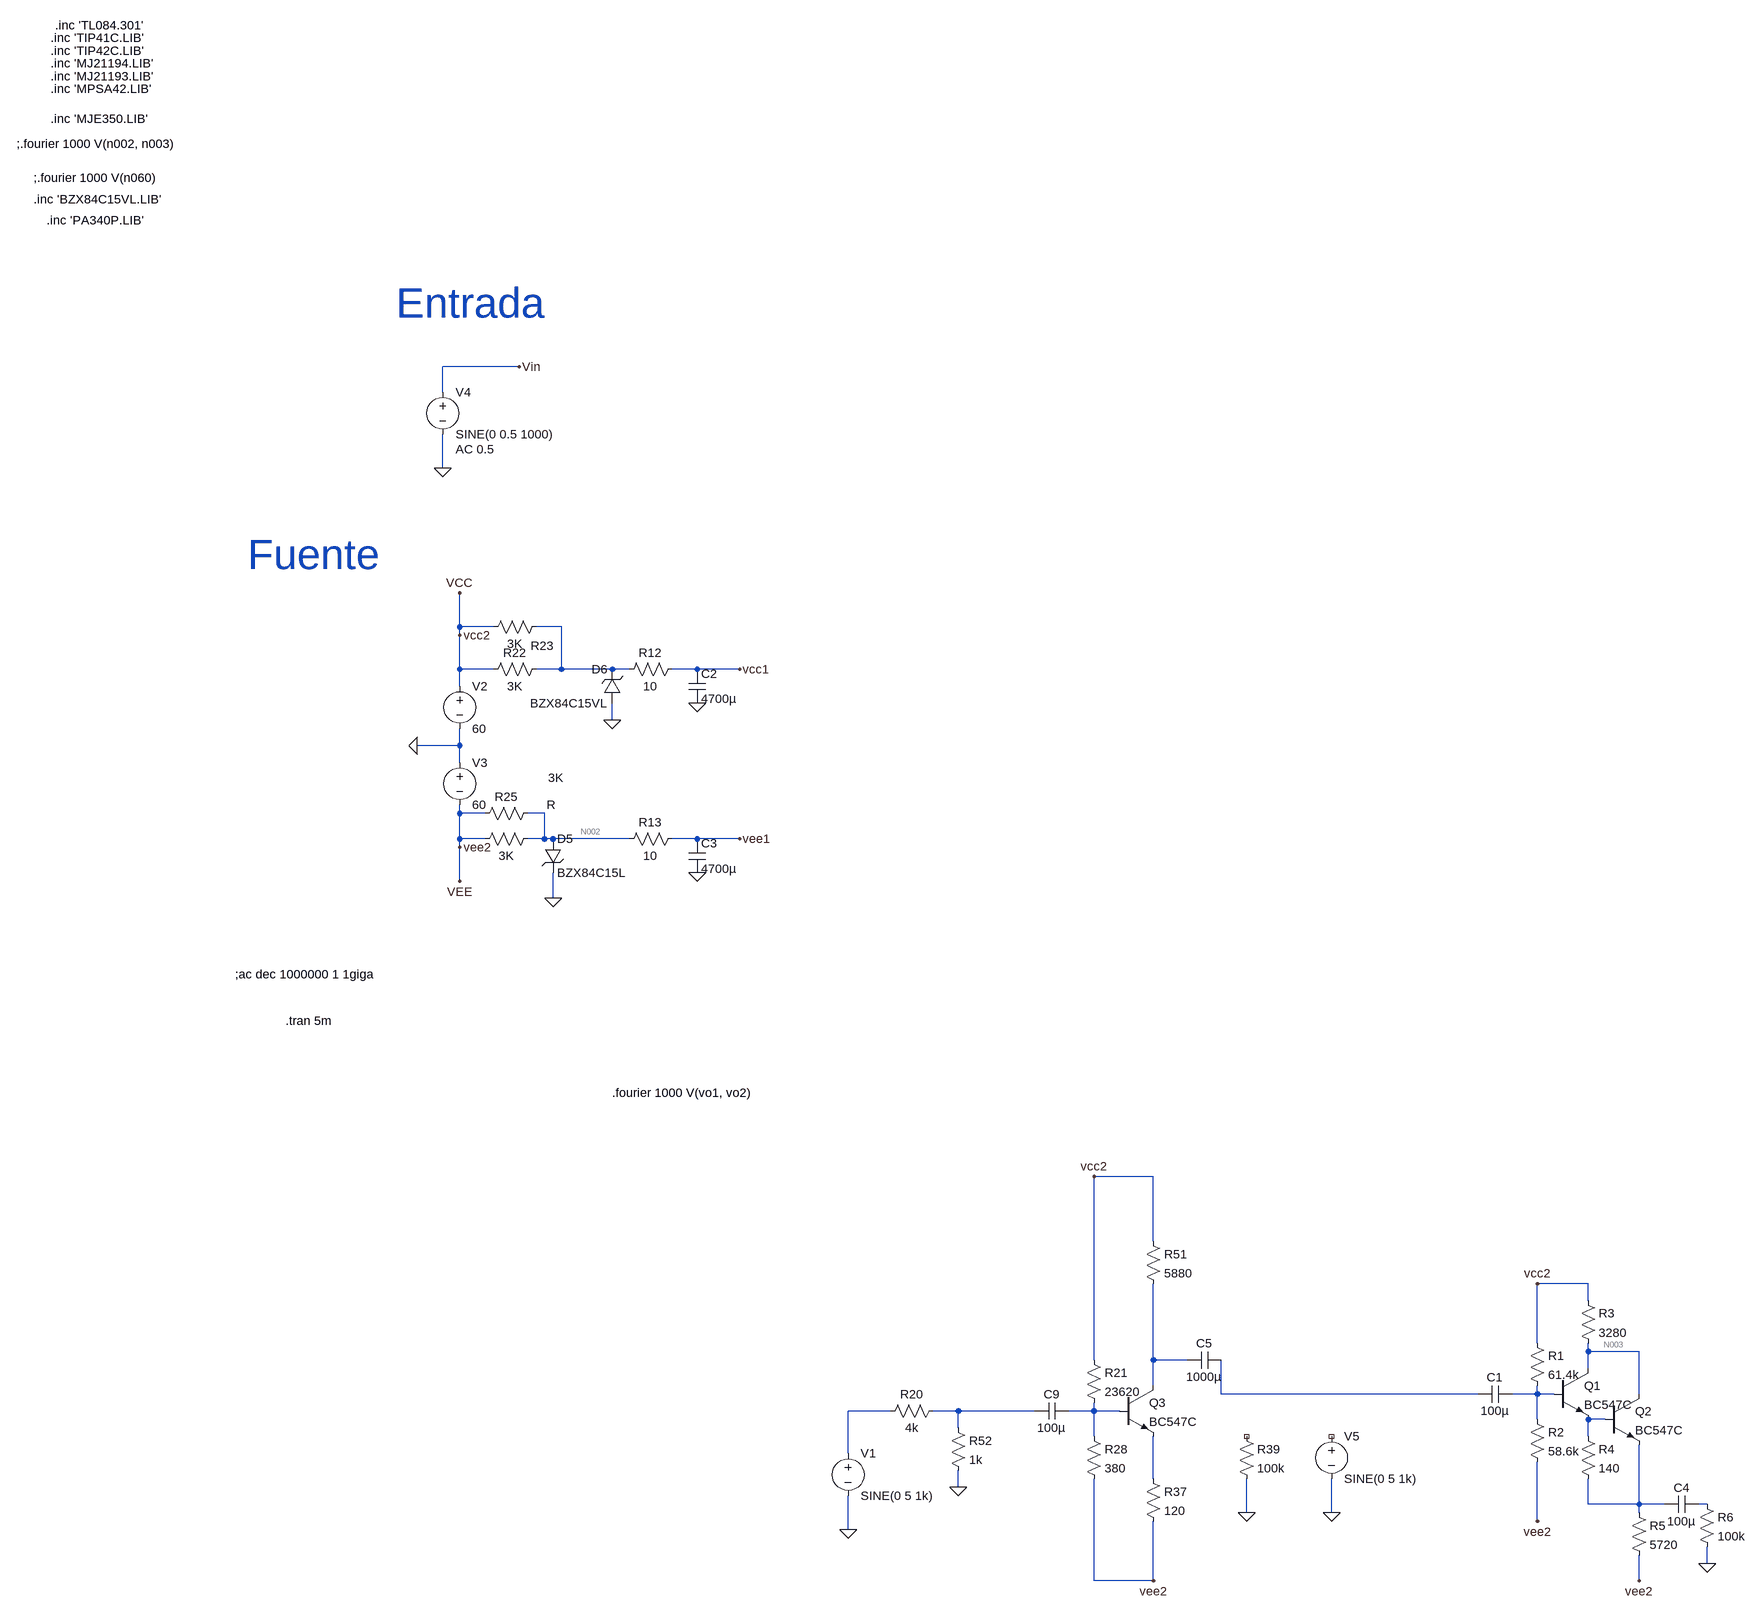
[diagram p0: schematic tetas.asc]
tetas.asc, the LTspice schematic file:
Version 4
SHEET 1 14776 4996
WIRE 3760 -64 3616 -64
WIRE 3616 -16 3616 -64
WIRE 3616 128 3616 64
WIRE 3648 976 3648 912
WIRE 3712 976 3648 976
WIRE 3840 976 3792 976
WIRE 3648 992 3648 976
WIRE 3648 1056 3648 992
WIRE 3712 1056 3648 1056
WIRE 3840 1056 3840 976
WIRE 3840 1056 3792 1056
WIRE 3936 1056 3840 1056
WIRE 3968 1056 3936 1056
WIRE 4096 1056 4048 1056
WIRE 4176 1056 4096 1056
WIRE 3648 1088 3648 1056
WIRE 3936 1152 3936 1120
WIRE 3648 1200 3648 1168
WIRE 3648 1200 3568 1200
WIRE 3648 1232 3648 1200
WIRE 3648 1328 3648 1312
WIRE 3696 1328 3648 1328
WIRE 3808 1328 3776 1328
WIRE 3648 1376 3648 1328
WIRE 3696 1376 3648 1376
WIRE 3808 1376 3808 1328
WIRE 3808 1376 3776 1376
WIRE 3824 1376 3808 1376
WIRE 3968 1376 3824 1376
WIRE 4096 1376 4048 1376
WIRE 4176 1376 4096 1376
WIRE 3648 1392 3648 1376
WIRE 3648 1456 3648 1392
WIRE 3824 1488 3824 1440
WIRE 8000 4128 7888 4128
WIRE 8000 4256 8000 4128
WIRE 8896 4336 8800 4336
WIRE 8896 4368 8896 4336
WIRE 8800 4448 8800 4336
WIRE 8896 4464 8896 4448
WIRE 8992 4464 8896 4464
WIRE 7888 4480 7888 4128
WIRE 8000 4480 8000 4336
WIRE 8064 4480 8000 4480
WIRE 8896 4496 8896 4464
WIRE 8000 4528 8000 4480
WIRE 8128 4544 8128 4480
WIRE 8688 4544 8128 4544
WIRE 8800 4544 8800 4528
WIRE 8800 4544 8752 4544
WIRE 8832 4544 8800 4544
WIRE 8992 4544 8992 4464
WIRE 7504 4576 7424 4576
WIRE 7632 4576 7584 4576
WIRE 7776 4576 7632 4576
WIRE 7888 4576 7888 4560
WIRE 7888 4576 7840 4576
WIRE 7936 4576 7888 4576
WIRE 8800 4592 8800 4544
WIRE 8928 4592 8896 4592
WIRE 7632 4608 7632 4576
WIRE 7888 4624 7888 4576
WIRE 8896 4624 8896 4592
WIRE 7424 4656 7424 4576
WIRE 8000 4704 8000 4624
WIRE 7632 4720 7632 4688
WIRE 8896 4752 8896 4704
WIRE 8992 4752 8992 4640
WIRE 8992 4752 8896 4752
WIRE 9040 4752 8992 4752
WIRE 9120 4752 9104 4752
WIRE 8176 4768 8176 4704
WIRE 8336 4768 8336 4704
WIRE 8992 4768 8992 4752
WIRE 8800 4784 8800 4672
WIRE 7424 4800 7424 4736
WIRE 9120 4864 9120 4832
WIRE 7888 4896 7888 4704
WIRE 8000 4896 8000 4784
WIRE 8000 4896 7888 4896
WIRE 8992 4896 8992 4848
FLAG 3568 1200 0
FLAG 3616 128 0
FLAG 3760 -64 Vin
FLAG 3648 912 VCC
FLAG 3648 1456 VEE
FLAG 3648 992 vcc2
FLAG 3648 1392 vee2
FLAG 4176 1056 vcc1
FLAG 4176 1376 vee1
FLAG 3936 1152 0
FLAG 3824 1488 0
FLAG 4096 1120 0
FLAG 4096 1440 0
FLAG 7424 4800 0
FLAG 7888 4128 vcc2
FLAG 8000 4896 vee2
FLAG 8176 4768 0
FLAG 7632 4720 0
FLAG 8336 4768 0
FLAG 8800 4336 vcc2
FLAG 8800 4784 vee2
FLAG 8992 4896 vee2
FLAG 9120 4864 0
SYMBOL voltage 3648 1072 R0
WINDOW 123 0 0 Left 0
WINDOW 39 24 44 Left 2
SYMATTR InstName V2
SYMATTR Value 60
SYMBOL voltage 3648 1216 R0
WINDOW 123 0 0 Left 0
WINDOW 39 24 124 Left 2
SYMATTR InstName V3
SYMATTR Value 60
SYMBOL voltage 3616 -32 R0
WINDOW 123 24 124 Left 2
WINDOW 39 0 0 Left 0
SYMATTR Value2 AC 0.5
SYMATTR InstName V4
SYMATTR Value SINE(0 0.5 1000)
SYMBOL res 3808 1040 R90
WINDOW 0 0 56 VBottom 2
WINDOW 3 32 56 VTop 2
SYMATTR InstName R22
SYMATTR Value 3K
SYMBOL res 3792 1360 R90
WINDOW 0 -33 -29 VBottom 2
WINDOW 3 32 56 VTop 2
SYMATTR InstName R
SYMATTR Value 3K
SYMBOL zener 3808 1376 R0
SYMATTR InstName D5
SYMATTR Value BZX84C15L
SYMBOL zener 3952 1120 R180
WINDOW 0 24 64 Left 2
WINDOW 3 24 0 Left 2
SYMATTR InstName D6
SYMATTR Value BZX84C15VL
SYMBOL res 3808 960 R90
WINDOW 0 67 4 VBottom 2
WINDOW 3 32 56 VTop 2
SYMATTR InstName R23
SYMATTR Value 3K
SYMBOL res 3792 1312 R90
WINDOW 0 0 56 VBottom 2
WINDOW 3 -67 -38 VTop 2
SYMATTR InstName R25
SYMATTR Value 3K
SYMBOL res 4064 1040 R90
WINDOW 0 0 56 VBottom 2
WINDOW 3 32 56 VTop 2
SYMATTR InstName R12
SYMATTR Value 10
SYMBOL res 4064 1360 R90
WINDOW 0 0 56 VBottom 2
WINDOW 3 32 56 VTop 2
SYMATTR InstName R13
SYMATTR Value 10
SYMBOL cap 4080 1056 R0
SYMATTR InstName C2
SYMATTR Value 4700µ
SYMBOL cap 4080 1376 R0
SYMATTR InstName C3
SYMATTR Value 4700µ
SYMBOL voltage 7424 4640 R0
WINDOW 123 0 0 Left 0
WINDOW 39 0 0 Left 0
SYMATTR InstName V1
SYMATTR Value SINE(0 5 1k)
SYMBOL cap 7840 4560 R90
WINDOW 0 0 32 VBottom 2
WINDOW 3 32 32 VTop 2
SYMATTR InstName C9
SYMATTR Value 100µ
SYMBOL res 7872 4464 R0
SYMATTR InstName R21
SYMATTR Value 23620
SYMBOL res 7872 4608 R0
SYMATTR InstName R28
SYMATTR Value 380
SYMBOL npn 7936 4528 R0
SYMATTR InstName Q3
SYMATTR Value BC547C
SYMBOL res 7984 4688 R0
SYMATTR InstName R37
SYMATTR Value 120
SYMBOL res 8160 4608 R0
SYMATTR InstName R39
SYMATTR Value 100k
SYMBOL res 7984 4240 R0
SYMATTR InstName R51
SYMATTR Value 5880
SYMBOL res 7600 4560 R90
WINDOW 0 0 56 VBottom 2
WINDOW 3 32 56 VTop 2
SYMATTR InstName R20
SYMATTR Value 4k
SYMBOL res 7616 4592 R0
SYMATTR InstName R52
SYMATTR Value 1k
SYMBOL voltage 8336 4608 R0
WINDOW 123 0 0 Left 0
WINDOW 39 0 0 Left 0
SYMATTR InstName V5
SYMATTR Value SINE(0 5 1k)
SYMBOL cap 8752 4528 R90
WINDOW 0 0 32 VBottom 2
WINDOW 3 32 32 VTop 2
SYMATTR InstName C1
SYMATTR Value 100µ
SYMBOL res 8784 4432 R0
SYMATTR InstName R1
SYMATTR Value 61.4k
SYMBOL res 8784 4576 R0
SYMATTR InstName R2
SYMATTR Value 58.6k
SYMBOL npn 8832 4496 R0
SYMATTR InstName Q1
SYMATTR Value BC547C
SYMBOL npn 8928 4544 R0
SYMATTR InstName Q2
SYMATTR Value BC547C
SYMBOL res 8880 4352 R0
SYMATTR InstName R3
SYMATTR Value 3280
SYMBOL res 8880 4608 R0
SYMATTR InstName R4
SYMATTR Value 140
SYMBOL res 8976 4752 R0
SYMATTR InstName R5
SYMATTR Value 5720
SYMBOL cap 9104 4736 R90
WINDOW 0 0 32 VBottom 2
WINDOW 3 32 32 VTop 2
SYMATTR InstName C4
SYMATTR Value 100µ
SYMBOL res 9104 4736 R0
SYMATTR InstName R6
SYMATTR Value 100k
SYMBOL cap 8128 4464 R90
WINDOW 0 0 32 VBottom 2
WINDOW 3 32 32 VTop 2
SYMATTR InstName C5
SYMATTR Value 1000µ
TEXT -568 -744 Left 2 !.inc 'TL084.301'
TEXT -576 -720 Left 2 !.inc 'TIP41C.LIB'
TEXT -640 -520 Left 2 !;.fourier 1000 V(n002, n003)
TEXT -576 -696 Left 2 !.inc 'TIP42C.LIB'
TEXT -576 -672 Left 2 !.inc 'MJ21194.LIB'
TEXT -576 -648 Left 2 !.inc 'MJ21193.LIB'
TEXT -576 -624 Left 2 !.inc 'MPSA42.LIB'
TEXT -576 -568 Left 2 !.inc 'MJE350.LIB'
TEXT -608 -456 Left 2 !;.fourier 1000 V(n060)
TEXT 3248 840 Left 6 ;Fuente
TEXT 3528 -184 Left 6 ;Entrada
TEXT 3224 1888 Left 2 !;ac dec 1000000 1 1giga
TEXT 3936 2176 Left 2 !.fourier 1000 V(vo1, vo2)
TEXT -608 -416 Left 2 !.inc 'BZX84C15VL.LIB'
TEXT -584 -376 Left 2 !.inc 'PA340P.LIB'
TEXT 3320 1976 Left 2 !.tran 5m

The netlist it stands for:
* tetas.asc
V2 vcc2 0 60
V3 0 vee2 60
V4 Vin 0 SINE(0 0.5 1000) AC 0.5
R22 N001 vcc2 3K
R N002 vee2 3K
D5 N002 0 BZX84C15L
D6 0 N001 BZX84C15VL
R23 N001 vcc2 3K
R25 N002 vee2 3K
R12 vcc1 N001 10
R13 vee1 N002 10
C2 vcc1 0 4700µ
C3 vee1 0 4700µ
V1 N007 0 SINE(0 5 1k)
C9 N009 N008 100µ
R21 vcc2 N009 23620
R28 N009 vee2 380
Q3 N004 N009 N011 0 BC547C
R37 N011 vee2 120
R39 NC_01 0 100k
R51 vcc2 N004 5880
R20 N008 N007 4k
R52 N008 0 1k
V5 NC_02 0 SINE(0 5 1k)
C1 N006 N005 100µ
R1 vcc2 N006 61.4k
R2 N006 vee2 58.6k
Q1 N003 N006 N010 0 BC547C
Q2 N003 N010 N012 0 BC547C
R3 vcc2 N003 3280
R4 N010 N012 140
R5 N012 vee2 5720
C4 N013 N012 100µ
R6 N013 0 100k
C5 N005 N004 1000µ
.model D D
.lib standard.dio
.model NPN NPN
.model PNP PNP
.lib standard.bjt
.inc 'TL084.301'
.inc 'TIP41C.LIB'
;.fourier 1000 V(n002, n003)
.inc 'TIP42C.LIB'
.inc 'MJ21194.LIB'
.inc 'MJ21193.LIB'
.inc 'MPSA42.LIB'
.inc 'MJE350.LIB'
;.fourier 1000 V(n060)
* Fuente
* Entrada
;ac dec 1000000 1 1giga
.fourier 1000 V(vo1, vo2)
.inc 'BZX84C15VL.LIB'
.inc 'PA340P.LIB'
.tran 5m
.backanno
.end